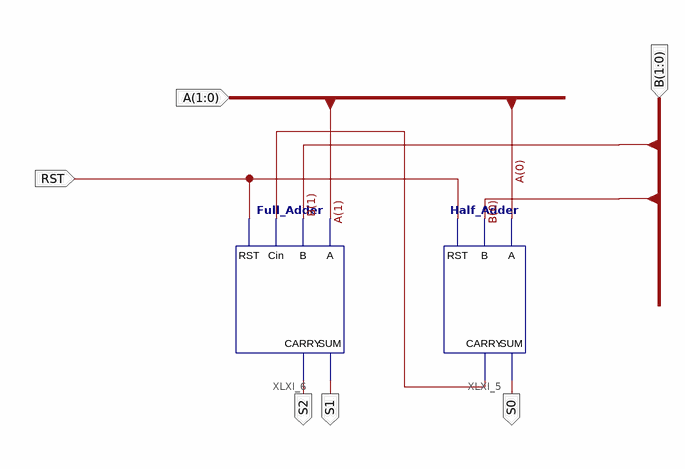
[diagram p0: schematic sheet 1]
// Xilinx ISE schematic Two_Bit_Adder_Extend.sch (spartan6) as structural Verilog: 2 symbols, 6 ports
module Two_Bit_Adder_Extend (
  input  RST,
  input  [1:0] B,
  input  [1:0] A,
  output S2,
  output S1,
  output S0
);

  wire A1;

  Full_Adder XLXI_6 (.A(A[1]), .B(B[1]), .CARRY(S2), .Cin(A1), .RST(RST), .SUM(S1));
  Half_Adder XLXI_5 (.A(A[0]), .B(B[0]), .CARRY(A1), .RST(RST), .SUM(S0));
endmodule
